# Altium schematic sheet 15-Sensors.SchDoc
size A4
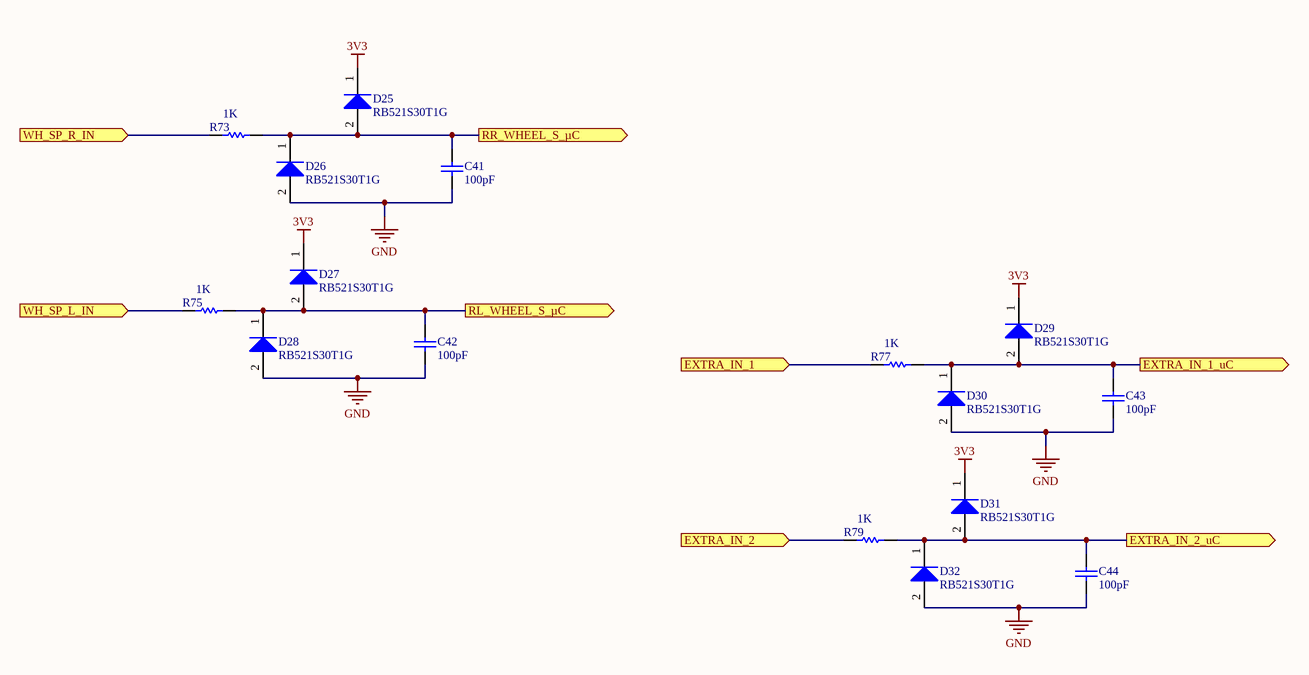
[diagram p0: 15-Sensors.SchDoc]

## Parts
C41  value 100pF  [1608[0603]]  (hidden comment: Cap)
C42  value 100pF  [1608[0603]]  (hidden comment: Cap)
C43  value 100pF  [1608[0603]]  (hidden comment: Cap)
C44  value 100pF  [1608[0603]]  (hidden comment: Cap)
D25  RB521S30T1G  [ONSC-SOD-523-2-502-01_V]
D26  RB521S30T1G  [ONSC-SOD-523-2-502-01_V]
D27  RB521S30T1G  [ONSC-SOD-523-2-502-01_V]
D28  RB521S30T1G  [ONSC-SOD-523-2-502-01_V]
D29  RB521S30T1G  [ONSC-SOD-523-2-502-01_V]
D30  RB521S30T1G  [ONSC-SOD-523-2-502-01_V]
D31  RB521S30T1G  [ONSC-SOD-523-2-502-01_V]
D32  RB521S30T1G  [ONSC-SOD-523-2-502-01_V]
R73  value 1K  [1608[0603]]  (hidden comment: Res1)
R75  value 1K  [1608[0603]]  (hidden comment: Res1)
R77  value 1K  [1608[0603]]  (hidden comment: Res1)
R79  value 1K  [1608[0603]]  (hidden comment: Res1)

## Ports
EXTRA_IN_1 (in), EXTRA_IN_1_uC (out), EXTRA_IN_2 (in), EXTRA_IN_2_uC (out), RL_WHEEL_S_µC (out), RR_WHEEL_S_µC (out), WH_SP_L_IN (in), WH_SP_R_IN (in)

## Nets
3V3: D25.1(K) D27.1(K) D29.1(K) D31.1(K)
GND: C41.1 C42.1 C43.1 C44.1 D26.2(A) D28.2(A) D30.2(A) D32.2(A)
EXTRA_IN_1: R77.1 ; port EXTRA_IN_1
EXTRA_IN_1_uC: C43.2 D29.2(A) D30.1(K) R77.2 ; port EXTRA_IN_1_uC
EXTRA_IN_2: R79.1 ; port EXTRA_IN_2
EXTRA_IN_2_uC: C44.2 D31.2(A) D32.1(K) R79.2 ; port EXTRA_IN_2_uC
RL_WHEEL_S_µC: C42.2 D27.2(A) D28.1(K) R75.2 ; port RL_WHEEL_S_µC
RR_WHEEL_S_µC: C41.2 D25.2(A) D26.1(K) R73.2 ; port RR_WHEEL_S_µC
WH_SP_L_IN: R75.1 ; port WH_SP_L_IN
WH_SP_R_IN: R73.1 ; port WH_SP_R_IN

## Library data of the parts
C41-C44 = Cap: Capacitor; Published: 8-Jun-2000; LatestRevisionDate: 17-Jul-2002; LatestRevisionNote: Re-released for DXP Platform.; PackageReference: RAD-0.3; Publisher: Altium Limited; PackageDescription: Radial Cap, Thru-Hole; 2 Leads; 0.3 in Pin Spacing
D25-D32 = CMP-1051-00018-1: Schottky Barrier Diode, 2-Pin SOD-523, Pb-Free, Tape and Reel; Manufacturer: On Semiconductor; Configuration: Single; IFSM Max (A): 1; Mounting Technology: Surface Mount; ComponentLink1Description: Manufacturer URL; PackageReference: SOD-523-2-502-01; RoHS: TRUE; ComponentLink3Description: Package Specification; ComponentLink2Description: Datasheet; PackageVersion: Rev. E, 09/2010; PartNumber: RB521S30T1G; ComponentLink3URL: http://www.onsemi.com/pub_link/Collateral/502-01.PDF; ComponentLink1URL: http://www.onsemi.com/; PackageDescription: 2-Pin SOD, Body 1.2 x 0.8 mm; DatasheetVersion: Rev. 8; ComponentLink2URL: http://www.onsemi.cn/pub_link/Collateral/RB521S30T1-D.PDF; Packing: Tape and Reel
R73 R75 R77 R79 = Res1: Resistor; Published: 8-Jun-2000; LatestRevisionDate: 17-Jul-2002; LatestRevisionNote: Re-released for DXP Platform.; PackageReference: AXIAL-0.3; Publisher: Altium Limited; PackageDescription: Axial Device, Thru-Hole; 2 Leads; 0.3 in Pin Spacing